# EAGLE design ESP32 (EAGLE 9.6.2)
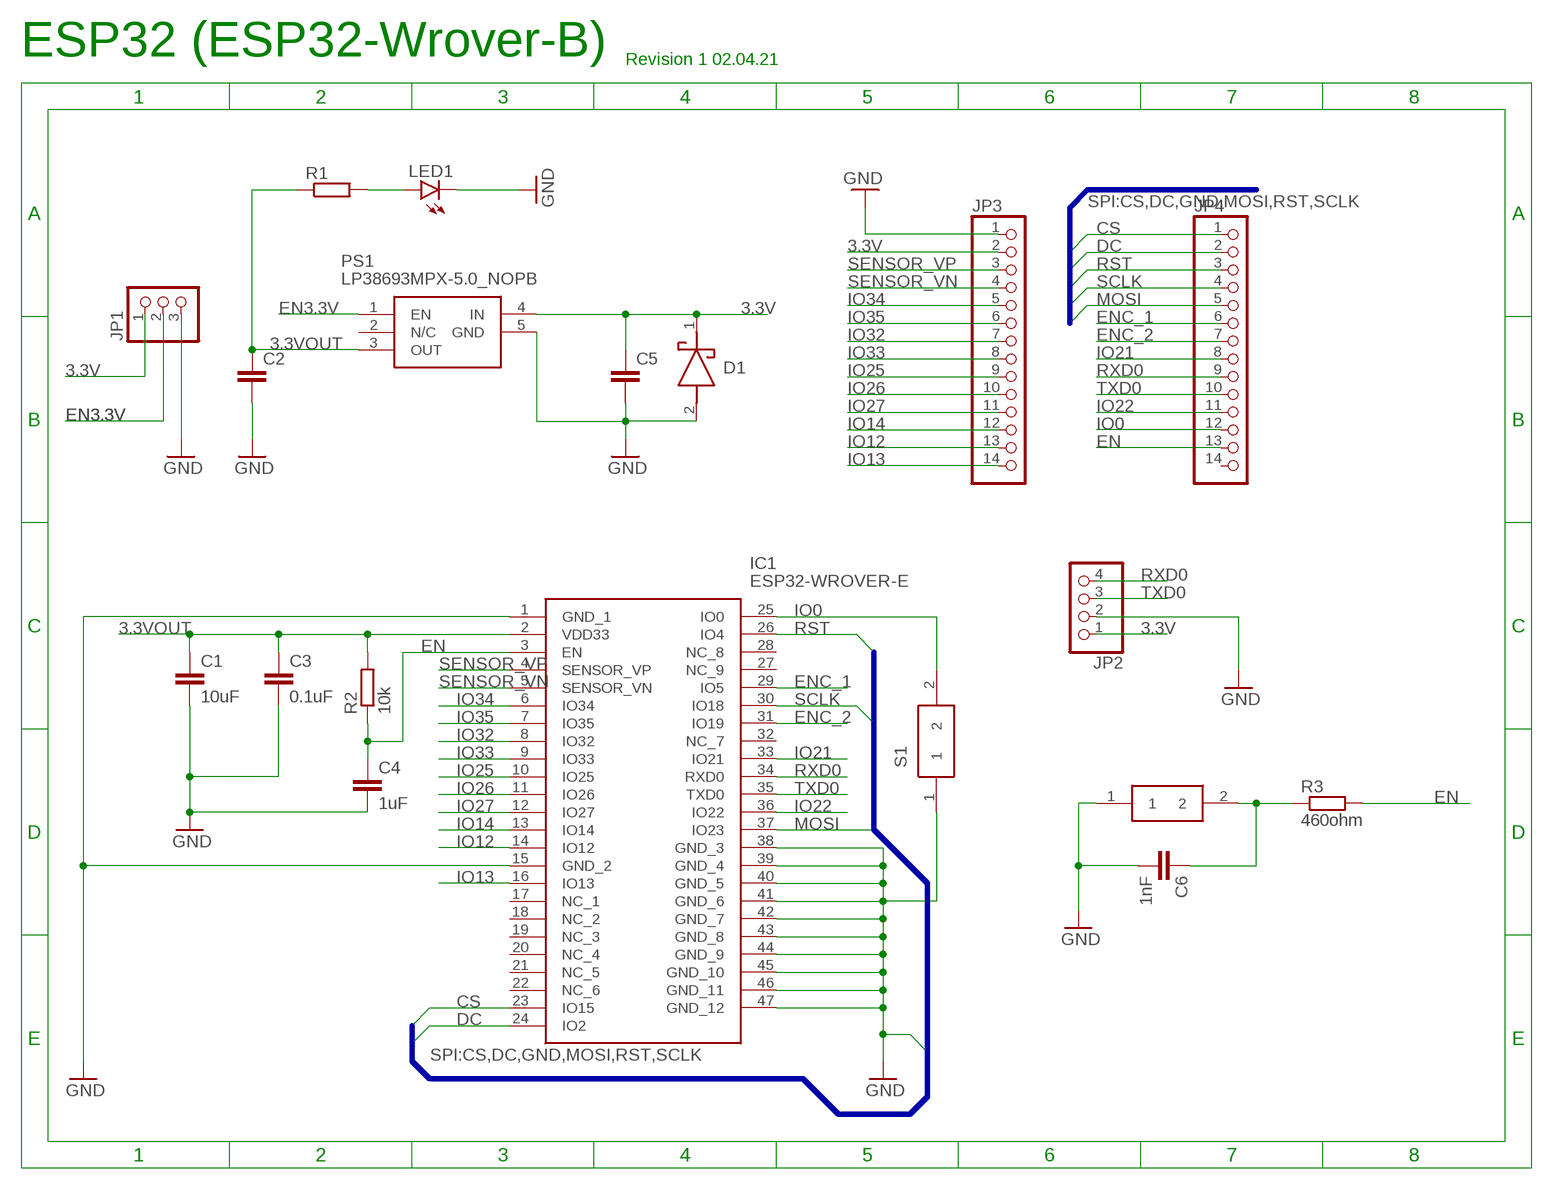
[diagram p0: schematic, sheet 1]

## Parts
C1  10uF  C-EU_1206C1206  [C1206]
C2  C-EUC0805  [C0805]
C3  0.1uF  C-EU_805C0805  [C0805]
C4  1uF  C-EU_805C0805  [C0805]
C5  C-EUC0805  [C0805]
C6  1nF  C-EU_805C0805  [C0805]
D1  LSM115JE3_TR13  [DIOM5436X330N]
IC1  ESP32-WROVER-E  [ESP32WROVERBM213DH6464PC3Q0]
JP1  PINHD-1X3  [1X03]
JP2  PINHD-1X4  [1X04]
JP3  PINHD-1X14  [1X14]
JP4  PINHD-1X14  [1X14]
LED1  LED_1206SMT1206  [1206]
PS1  LP38693MPX-5.0_NOPB  [SOT150P700X160-5N]
R1  R-EU_R0805  [R0805]
R2  10k  R-EU_805R0805  [R0805]
R3  460ohm  R-EU_805R0805  [R0805]
S1  FSMSMTR  [FSMSM]
S2  FSMSMTR  [FSMSM]

## Nets
3.3V: C5.1 D1.1(K) JP1.1 JP2.1 JP3.2 PS1.4(IN)
3.3VOUT: C1.1 C2.1 C3.1 IC1.2(VDD33) PS1.3(OUT) R1.1 R2.2
CS: IC1.23(IO15) JP4.1
DC: IC1.24(IO2) JP4.2
EN [other]: C4.1 IC1.3(EN) JP4.13 R2.1 R3.2
EN3.3V [other]: JP1.2 PS1.1(EN)
EN_1 [other]: C6.1 R3.1 S2.2
ENC_1: IC1.29(IO5) JP4.6
ENC_2: IC1.31(IO19) JP4.7
GND: C1.2 C2.2 C3.2 C4.2 C5.2 C6.2 D1.2(A) IC1.1(GND_1) IC1.15(GND_2) IC1.38(GND_3) IC1.39(GND_4) IC1.40(GND_5) IC1.41(GND_6) IC1.42(GND_7) IC1.43(GND_8) IC1.44(GND_9) IC1.45(GND_10) IC1.46(GND_11) IC1.47(GND_12) JP1.3 JP2.2 JP3.1 LED1.C PS1.5(GND) S1.1 S2.1
IO0 [other]: IC1.25(IO0) JP4.12 S1.2
IO12: IC1.14(IO12) JP3.13
IO13: IC1.16(IO13) JP3.14
IO14: IC1.13(IO14) JP3.12
IO21: IC1.33(IO21) JP4.8
IO22: IC1.36(IO22) JP4.11
IO25: IC1.10(IO25) JP3.9
IO26: IC1.11(IO26) JP3.10
IO27: IC1.12(IO27) JP3.11
IO32: IC1.8(IO32) JP3.7
IO33: IC1.9(IO33) JP3.8
IO34: IC1.6(IO34) JP3.5
IO35: IC1.7(IO35) JP3.6
MOSI: IC1.37(IO23) JP4.5
N$1: LED1.A R1.2
RST: IC1.26(IO4) JP4.3
RXD0 [other]: IC1.34(RXD0) JP2.4 JP4.9
SCLK: IC1.30(IO18) JP4.4
SENSOR_VN: IC1.5(SENSOR_VN) JP3.4
SENSOR_VP: IC1.4(SENSOR_VP) JP3.3
TXD0 [other]: IC1.35(TXD0) JP2.3 JP4.10
Unconnected: IC1.17(NC_1) IC1.18(NC_2) IC1.19(NC_3) IC1.20(NC_4) IC1.21(NC_5) IC1.22(NC_6) IC1.27(NC_9) IC1.28(NC_8) IC1.32(NC_7) JP4.14 PS1.2(N/C)

## Buses
SPI:CS,DC,GND,MOSI,RST,SCLK

## Notes on the sheet
- ESP32 (ESP32-Wrover-B)
- Revision 1 02.04.21

## Library data of the parts
C1 = CommonParts:C-EU_1206: CAPACITOR, European symbol; SPICEPREFIX: C
C2 C5 = rcl:C-EU: CAPACITOR, European symbol; SPICEPREFIX: C
C3 C4 C6 = CommonParts:C-EU_805: CAPACITOR, European symbol; SPICEPREFIX: C
D1 = CommonParts:LSM115JE3_TR13: Schottky Diodes & Rectifiers Schottky Source: Datasheet <https://componentsearchengine.com/Datasheets/1/LSM115JE3_TR13.pdf>; DESCRIPTION: Schottky Diodes & Rectifiers Schottky; HEIGHT: 3.3mm; MANUFACTURER_NAME: Microsemi Corporation; MANUFACTURER_PART_NUMBER: LSM115JE3/TR13; MOUSER_PART_NUMBER: 494-LSM115JE3/TR13; MOUSER_PRICE-STOCK: https://www.mouser.com/Search/Refine.aspx?Keyword=494-LSM115JE3%2FTR13
IC1 = MouserUseful:ESP32-WROVER-E: RX TXRX MOD WIFI PCB TRACE SMD Source: Datasheet <https://www.mouser.de/datasheet/2/891/esp32-wrover-e_esp32-wrover-ie_datasheet_en-1855913.pdf>; DESCRIPTION: RX TXRX MOD WIFI PCB TRACE SMD; HEIGHT: 3.4mm; MANUFACTURER_NAME: Espressif Systems; MANUFACTURER_PART_NUMBER: ESP32-WROVER-E(M213EH3264PH3Q0)
JP1 = pinhead:PINHD-1X3: PIN HEADER
JP2 = pinhead:PINHD-1X4: PIN HEADER
JP3 JP4 = pinhead:PINHD-1X14: PIN HEADER
LED1 = CommonParts:LED_1206: LED OSRAM: - CHIPLED LG R971, LG N971, LY N971, LG Q971, LY Q971, LO R971, LY R971 LH N974, LH R974 LS Q976, LO Q976, LY Q976 LO Q996 - Hyper CHIPLED LW Q18S LB Q993, LB Q99A, LB R99A - SideLED LS A670, LO A670, LY A670, LG A670, LP A670 LB A673, LV A673, LT A673, LW A673 LH A674 LY A675 LS A676, LA A676, LO A676, LY A676, LW A676 LS A679, LY A679, LG A679 - Hyper Micro SIDELED® LS Y876, LA Y876, LO Y876, LY Y876 LT Y87S - SmartLED LW L88C, LW L88S LB L89C, LB L89S, LG L890 LS L89K, LO L89K, LY L89K LS L896, LA L896, LO L896, LY L896 - TOPLED LS T670, LO T670, LY T670, LG T670, LP T670 LSG T670, LSP T670, LSY T670, LOP T670, LYG T670 LG T671, LOG T671, LSG T671 LB T673, LV T673, LT T673, LW T673 LH T674 LS T676, LA T676, LO T676, LY T676, LB T676, LH T676, LSB T676, LW T676 LB T67C, LV T67C, LT T67C, LS T67K, LO T67K, LY T67K, LW E67C LS E67B, LA E67B, LO E67B, LY E67B, LB E67C, LV E67C, LT E67C LW T67C LS T679, LY T679, LG T679 LS T770, LO T770, LY T770, LG T770, LP T770 LB T773, LV T773, LT T773, LW T773 LH T774 LS E675, LA E675, LY E675, LS T675 LS T776, LA T776, LO T776, LY T776, LB T776 LHGB T686 LT T68C, LB T68C - Hyper Mini TOPLED® LB M676 - Mini TOPLED Santana® LG M470 LS M47K, LO M47K, LY M47K Source: http://www.osram.convergy.de LUXEON: - LUMILED® LXK2-PW12-R00, LXK2-PW12-S00, LXK2-PW14-U00, LXK2-PW14-V00 LXK2-PM12-R00, LXK2-PM12-S00, LXK2-PM14-U00 LXK2-PE12-Q00, LXK2-PE12-R00, LXK2-PE12-S00, LXK2-PE14-T00, LXK2-PE14-U00 LXK2-PB12-K00, LXK2-PB12-L00, LXK2-PB12-M00, LXK2-PB14-N00, LXK2-PB14-P00, LXK2-PB14-Q00 LXK2-PR12-L00, LXK2-PR12-M00, LXK2-PR14-Q00, LXK2-PR14-R00 LXK2-PD12-Q00, LXK2-PD12-R00, LXK2-PD12-S00 LXK2-PH12-R00, LXK2-PH12-S00 LXK2-PL12-P00, LXK2-PL12-Q00, LXK2-PL12-R00 Source: www.luxeon.com KINGBRIGHT: KA-3528ASYC Source: www.kingbright.com
PS1 = MouserUseful:LP38693MPX-5.0_NOPB: LDO Voltage Regulators 500mA Low Dropout CMOS Linear Regulators Stable with Ceramic Output Capacitors 5-SOT-223 -40 to 125 Source: Datasheet <http://www.ti.com/lit/ds/snvs321o/snvs321o.pdf>
R1 = rcl:R-EU_: RESISTOR, European symbol; SPICEPREFIX: R
R2 R3 = CommonParts:R-EU_805: RESISTOR, European symbol
S1 S2 = FSMSMTR:FSMSMTR: Black Button Tact Switch, SPST 50 mA @ 24 V dc 1.07mm Source: Datasheet <http://www.te.com/commerce/DocumentDelivery/DDEController?Action=showdoc&DocId=Customer Drawing1437566-3C2pdfEnglishENG_CD_1437566-3_C2_1437566_3_1_c.dwg.pdf1437566-4>; ALLIED_NUMBER: 70286948; ALLIED_PRICE-STOCK: https://www.alliedelec.com/te-connectivity-fsmsmtr/70286948/; DESCRIPTION: Black Button Tact Switch, SPST 50 mA @ 24 V dc 1.07mm; HEIGHT: mm; MANUFACTURER_NAME: TE Connectivity; MANUFACTURER_PART_NUMBER: FSMSMTR; MOUSER_PART_NUMBER: 506-FSMSMTR; MOUSER_PRICE-STOCK: https://www.mouser.com/Search/Refine.aspx?Keyword=506-FSMSMTR; RS_PART_NUMBER: 1680547; RS_PRICE-STOCK: http://uk.rs-online.com/web/p/products/1680547

## Net classes
0 default: width 0.152 mm, drill 0.1 mm
1 other: width 0.152 mm, drill 0.1 mm, clearance 0.205 mm to class 0, clearance 0.205 mm

## Board
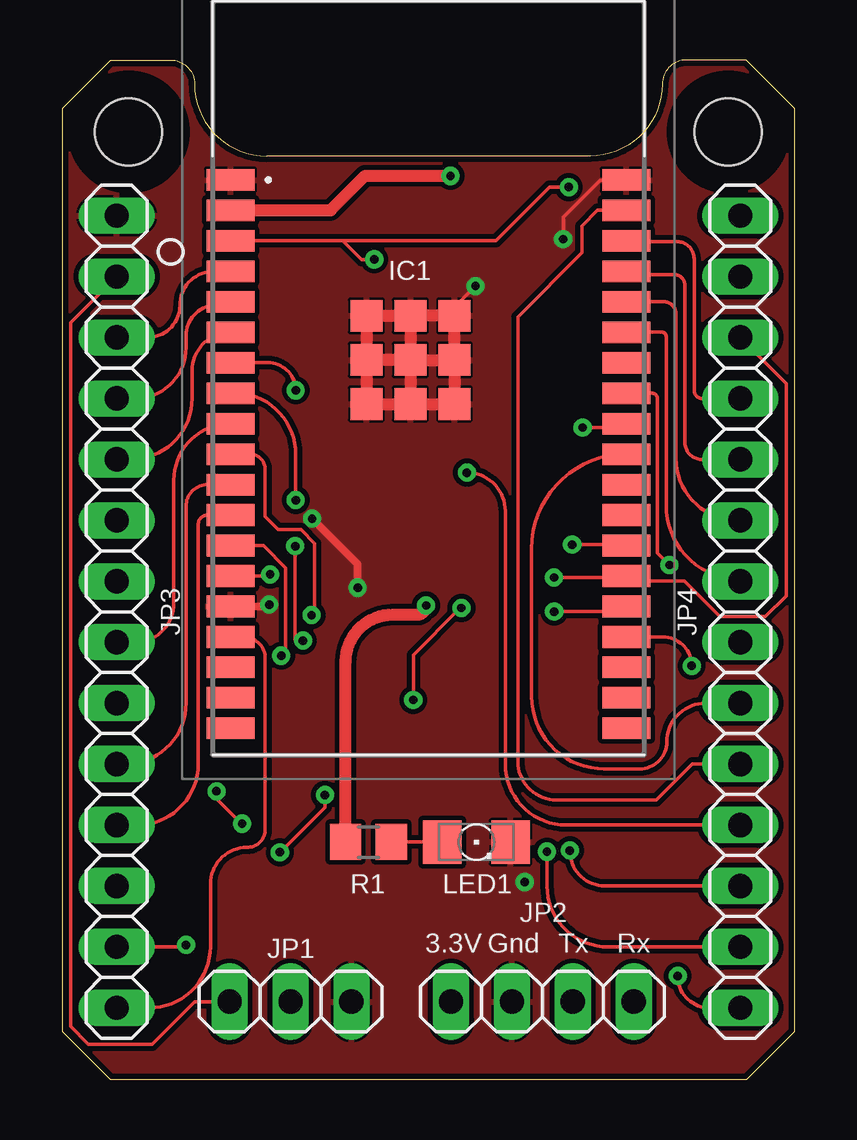
[diagram p1: board, top side]
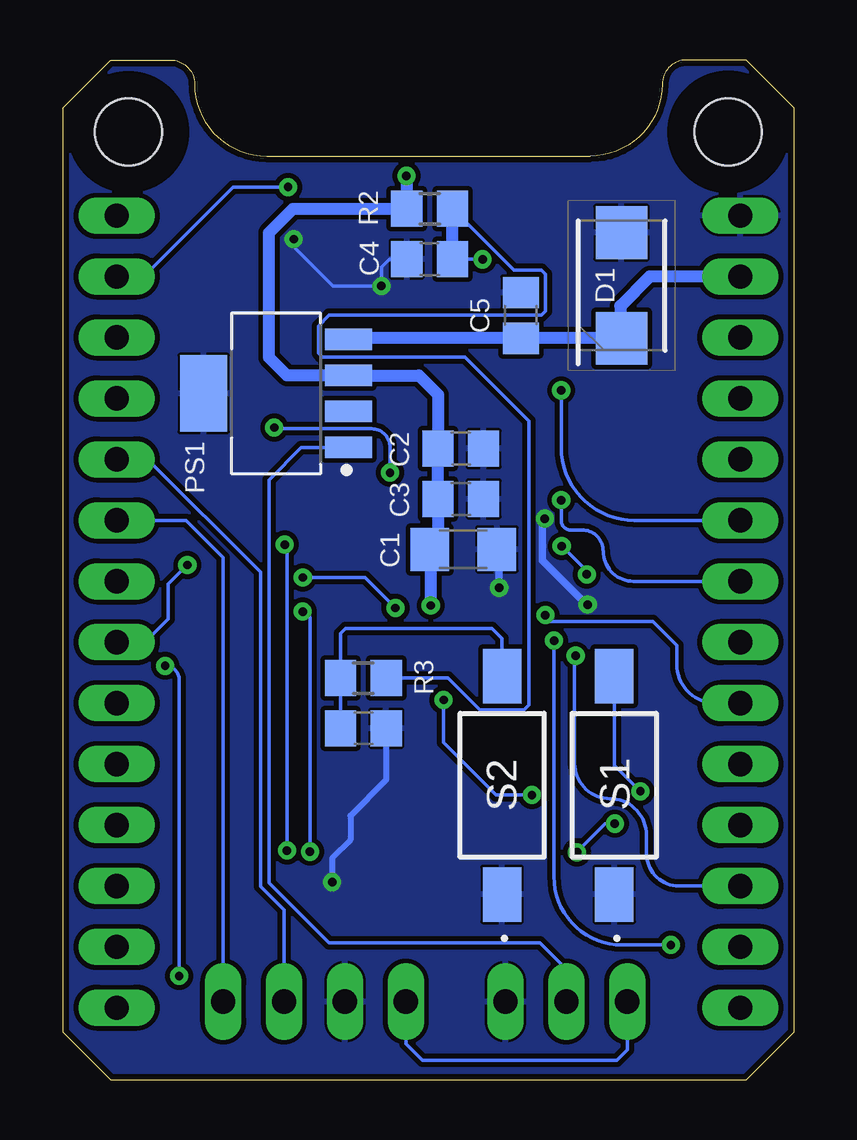
[diagram p2: board, bottom side, seen from below]

Size 30.5 x 42.5 mm. Coordinates in mm from the lower left corner, seen from the top.
Outline: 30.5,40.5 30.5,2 28.5,0 2,0 0,2 0,40.5 2,42.5 4.5,42.5 arc-90 5.5,41.5 arc90 8.5,38.5 22,38.5 arc90 25,41.5 arc-90 26,42.5 28.5,42.5 30.5,40.5
Copper layers (1*16): Top 0.035mm / dielectric 1.5mm / Bottom 0.035mm
Design rules "CNC *": minimum track width 6mil, minimum drill 0.35mm, track to track 0.2mm, track to pad 0.2mm, pad to pad 0.2mm, via to via 0.2mm, smd to smd 0.2mm, copper to edge 10mil, drill to drill 6mil, minimum pad ring 10mil, minimum via ring 8mil, stop-mask expansion 0.1mm, vias tented up to drill 0.1mm, thermal gap 0.1mm
Holes 2.8 mm at 27.75,39.5 2.75,39.5
tRestrict: area 1.5,38.2 to 4,40.8; area 26.5,38.2 to 29,40.8
bRestrict: area 1.5,38.2 to 4,40.8; area 26.5,38.2 to 29,40.8

### Footprints (pad centres in the part's own frame; a part is rotated, then mirrored left to right if it is on the bottom)
C1206 = smd 1.6 x 1.8: 1 -1.4,0; 2 1.4,0
C0805 = smd 1.3 x 1.5: 1 -0.95,0; 2 0.95,0
DIOM5436X330N = smd 2.2 x 2.15: 1 -2.2,0; 2 2.2,0
ESP32WROVERBM213DH6464PC3Q0 = smd 2 x 0.9: 1 -7.5,7.5; 2 -7.5,6.23; 3 -7.5,4.96; 4 -7.5,3.69; 5 -7.5,2.42; 6 -7.5,1.15; 7 -7.5,-0.12; 8 -7.5,-1.39; 9 -7.5,-2.66; 10 -7.5,-3.93; 11 -7.5,-5.2; 12 -7.5,-6.47; 13 -7.5,-7.74; 14 -7.5,-9.01; 15 -7.5,-10.28; 16 -7.5,-11.55; 17 -7.5,-12.82; 18 -7.5,-14.09; 19 -7.5,-15.36; 20 9,-15.36; 21 9,-14.09; 22 9,-12.82; 23 9,-11.55; 24 9,-10.28; 25 9,-9.01; 26 9,-7.74; 27 9,-6.47; 28 9,-5.2; 29 9,-3.93; 30 9,-2.66; 31 9,-1.39; 32 9,-0.12; 33 9,1.15; 34 9,2.42; 35 9,3.69; 36 9,4.96; 37 9,6.23; 38 9,7.5 | smd 1.33 x 1.33: 39 -1.835,1.835; 40 0,1.835; 41 1.835,1.835; 42 -1.835,0; 43 0,0; 44 1.835,0; 45 -1.835,-1.835; 46 0,-1.835; 47 1.835,-1.835
1X03 = drill 1.016 long: 1 -2.54,0; 2 0,0; 3 2.54,0
1X04 = drill 1.016 long: 1 -3.81,0; 2 -1.27,0; 3 1.27,0; 4 3.81,0
1X14 = drill 1.016 long: 1 -16.51,0; 2 -13.97,0; 3 -11.43,0; 4 -8.89,0; 5 -6.35,0; 6 -3.81,0; 7 -1.27,0; 8 1.27,0; 9 3.81,0; 10 6.35,0; 11 8.89,0; 12 11.43,0; 13 13.97,0; 14 16.51,0
1206 = smd 1.6 x 1.803: A -1.422,0; C 1.422,0
SOT150P700X160-5N = smd 1.965 x 0.889: 1 -3.023,2.25; 2 -3.023,0.75; 3 -3.023,-0.75; 4 -3.023,-2.25 | smd 1.965 x 3.189: 5 3.023,0
R0805 = smd 1.3 x 1.5: 1 -0.95,0; 2 0.95,0
FSMSM = smd 2.27 x 1.6: 1 -4.55,0; 2 4.55,0

### Placement (x,y rotation side)
C1  13.8,22.1 0 bottom
C2  13.9,26.3 0 bottom
C3  13.9,24.2 0 bottom
C4  15.2,34.2 180 bottom
C5  11.4,31.85 90 bottom
C6  17.96,14.64 0 bottom
D1  7.2,33.1 90 bottom
IC1  14.5,30 0 top
JP1  9.5,3.25 0 top
JP2  20,3.25 0 top
JP3  2.25,19.5 270 top
JP4  28.25,19.5 90 top
LED1  17.25,9.9 0 top
PS1  21.6,28.6 180 bottom
R1  12.75,9.9 0 top
R2  15.2,36.3 180 bottom
R3  17.96,16.73 0 bottom
S1  7.5,12.26 90 bottom
S2  12.18,12.26 90 bottom

### Tracks (layer width: path | path; a pad name or v marks a point on that pad's centre or on a via)
3.3V
  Top 0.152: JP1.1 5.5,3.25 3.72,1.47 1.07,1.47 0.33,2.21 0.33,31.55 JP3.2
  Bottom 0.152: JP1.1 6.96,1.24 7.4,0.8 15.5,0.8 16.19,1.49 JP2.1
  Bottom 0.5: JP3.2 6.03,33.47 7.25,32.25 7.25,30.95 D1.1 | C5.1 18.53,30.9 PS1.4
  Bottom 0.508: D1.1 C5.1
3.3VOUT  (via drill 0.35)
  Top 0.5: R1.1 11.8,17.42 arc-90 13.76,19.38 14.77,19.38 arc90 v15.15,19.76 | IC1.2 11.18,36.23 12.61,37.67 v16.17,37.67
  Bottom 0.5: v15.15,19.76 15.15,22.05 arc-90 C1.1 14.85,22.45 C3.1 C2.1 14.85,28.55 15.65,29.35 PS1.3 21.15,29.35 21.9,30.1 21.9,35.3 20.9,36.3 R2.2 16.17,36.32 v16.17,37.67
CS  (via drill 0.35)
  Top 0.152: JP4.1 26.97,2.99 arc-90 v25.64,4.32 | v26.23,17.25 arc90 25.02,18.45 IC1.23
  Bottom 0.152: v25.64,4.32 25.64,16.66 arc-90 v26.23,17.25
DC  (via drill 0.35)
  Top 0.152: JP4.2 22.73,5.53 arc-90 20.19,8.07 v20.19,9.5 | v20.49,19.51 23.29,19.51 arc90 IC1.24
  Bottom 0.152: v20.19,9.5 20.19,19.2 arc-90 v20.49,19.51
EN  (via drill 0.35)
  Top 0.152: v12.99,34.19 12.46,34.19 11.67,34.97 | 11.67,34.97 7.01,34.97 IC1.3 | 11.67,34.97 18.07,34.97 20.3,37.2 v21.1,37.2
  Bottom 0.152: R3.2 14.43,16.73 13.1,15.4 11.26,15.4 11.06,15.61 11.06,27.46 13.72,30.12 19.68,30.12 19.84,30.29 19.84,31.41 19.38,31.87 10.53,31.87 10.37,32.03 10.37,33.57 10.53,33.73 11.68,33.73 R2.1 | C4.1 13.01,34.2 v12.99,34.19 | v21.1,37.2 23.4,37.2 27.13,33.47 JP4.13
  Bottom 0.5: C4.1 R2.1
EN3.3V
  Bottom 0.152: JP1.2 9.5,4.6 10.6,5.7 19.4,5.7 21.9,8.2 21.9,25 20.55,26.35 PS1.1
EN_1
  Bottom 0.152: S2.2 12.18,18.38 12.6,18.8 18.7,18.8 18.91,18.59 R3.1 C6.1
ENC_1
  Top 0.152: JP4.6 26.8,15.69 arc90 25.18,14.07 arc-90 24.07,12.95 22.57,12.95 arc-90 19.55,15.97 19.55,22.12 arc-90 IC1.29
ENC_2  (via drill 0.35)
  Top 0.152: IC1.31 24.56,28.61 arc-90 24.8,28.37 24.8,21.95 v25.3,21.45
  Bottom 0.152: v25.3,21.45 26.1,20.65 26.1,19.2 27.07,18.23 JP4.7
GND  (via drill 0.35)
  Top 0.152: IC1.41 16.34,32.2 v17.21,33.08 | v20.87,35.03 20.87,35.95 22.42,37.5 IC1.38
  Top 0.305: IC1.15 8.53,19.72 v8.61,19.8 | v10.4,23.38 12.3,21.48 v12.3,20.5
  Top 0.5: IC1.40 IC1.39 IC1.42 | IC1.40 IC1.41 IC1.44 | IC1.40 IC1.43 | IC1.43 IC1.44 | IC1.44 IC1.47 IC1.46 | IC1.42 IC1.45 IC1.46 | IC1.43 IC1.46 | IC1.43 IC1.42
  Bottom 0.152: C4.2 16.88,34.2 17.21,33.87 v17.21,33.08 19.23,33.08 20.87,34.72 v20.87,35.03
  Bottom 0.254: C6.2 17.01,12.49 18.5,11 18.5,10 19.26,9.24 v19.26,8.23
  Bottom 0.305: v8.61,19.8 8.66,19.8 10.5,21.64 10.5,23.28 v10.4,23.38 | v12.3,20.5 12.3,22 C1.2
  pour Top: 0,0 30.51,0 30.51,42.5 0,42.5
  pour Bottom: 0,0 30.54,0 30.54,42.5 0,42.5
IO0  (via drill 0.35)
  Top 0.152: v6.41,12.01 6.41,11.71 7.46,10.67 v7.48,10.67 | v9.06,9.47 10.94,11.35 v10.94,11.86 | v14.62,15.82 14.62,17.7 16.52,19.61 16.57,19.61 v16.62,19.66 | v20.49,20.93 23.44,20.93 IC1.25 23.7,20.79 25.91,20.79 27.4,19.3 29.3,19.3 30.16,20.16 30.16,29.02 JP4.12
  Bottom 0.152: S1.2 7.5,13.1 v6.41,12.01 | v7.48,10.67 7.89,10.67 9.08,9.47 v9.06,9.47 | v10.94,11.86 12.43,11.86 14.62,14.04 v14.62,15.82 | v20.49,20.93 17.89,20.93 v16.62,19.66
IO12  (via drill 0.35)
  Top 0.152: JP3.13 5.06,5.53 arc90 v5.14,5.61 | v8.65,21.05 arc90 8.58,20.99 IC1.14 | v10.02,18.3 9.72,18.3 9.69,18.32 v9.69,22.23
  Bottom 0.152: v5.14,5.61 7.18,5.61 arc90 10.02,8.45 v10.02,18.3 | v9.69,22.23 8.65,21.19 v8.65,21.05
IO13
  Top 0.152: JP3.14 3.62,2.99 arc90 6.16,5.53 6.16,8.15 arc-90 7.68,9.68 arc90 8.45,10.44 8.45,17.55 arc90 7.55,18.45 IC1.16
IO14  (via drill 0.35)
  Top 0.152: v9.11,17.67 9.3,17.86 9.3,21.33 8.37,22.26 IC1.13
  Bottom 0.152: JP3.12 4.81,8.07 arc90 6.16,9.42 6.16,10.18 arc-90 7.68,11.71 arc90 9.16,13.18 9.16,17.62 v9.11,17.67
IO21
  Top 0.152: JP4.8 28.25,20.85 arc-90 25.16,23.94 25.16,30.99 arc90 25,31.15 IC1.33
IO22
  Top 0.152: IC1.36 arc90 23.54,34.92 25.62,34.92 arc-90 26.33,34.21 26.33,28.73 arc90 26.66,28.39 JP4.11
IO25  (via drill 0.35)
  Top 0.152: v10.38,19.36 10.5,19.36 10.5,22.35 9.93,22.92 8.99,22.92 8.45,23.46 8.45,25.42 arc90 7.8,26.07 IC1.10
  Bottom 0.152: JP3.9 3.28,15.69 arc90 4.89,17.3 4.89,18.09 5.9,19.1 10.38,19.1 v10.38,19.36
IO26
  Top 0.152: JP3.10 2.6,13.15 arc90 5.14,15.69 5.14,23.9 arc-90 6.04,24.8 IC1.11
IO27
  Top 0.152: JP3.11 3.11,10.61 arc90 5.65,13.15 5.65,23.14 arc-90 6.04,23.53 IC1.12
IO32  (via drill 0.35)
  Top 0.152: v9.72,24.15 9.72,26.07 arc90 7.18,28.61 IC1.8
  Bottom 0.152: v9.72,24.15 9.72,23.31 arc-90 9.31,22.91 8.85,22.91 arc90 7.96,22.02 arc-90 6.71,20.77 JP3.7
IO33
  Top 0.152: JP3.8 3.03,18.23 arc90 4.64,19.84 4.64,24.98 arc-90 IC1.9
IO34
  Top 0.152: JP3.5 2.86,25.85 arc90 5.4,28.39 5.4,29.55 arc-90 IC1.6
IO35  (via drill 0.35)
  Top 0.152: v9.72,28.73 arc90 8.56,29.88 IC1.7
  Bottom 0.152: JP3.6 6.67,23.31 arc90 9.72,26.36 v9.72,28.73
MOSI
  Top 0.152: JP4.5 26.25,13.15 24.75,11.66 20.59,11.66 arc-90 18.97,13.27 18.97,31.79 21.64,34.46 21.64,35.58 22.3,36.24 IC1.37
N$1
  Top 0.152: LED1.A R1.2
RST  (via drill 0.35)
  Top 0.152: JP4.3 22.6,8.07 arc-90 21.15,9.52 v21.15,9.55 | v21.24,22.3 23.46,22.3 arc-90 IC1.26
  Bottom 0.152: v21.15,9.55 21.15,22.2 arc-90 v21.24,22.3
RXD0
  Top 0.152: JP4.9 28.16,23.31 arc-90 25.57,25.9 25.57,31.93 arc90 25.07,32.42 IC1.34
  Bottom 0.152: JP2.4 23.81,21.77 25.35,23.31 JP4.9
SCLK  (via drill 0.35)
  Top 0.152: JP4.4 20.99,10.61 arc-90 18.45,13.15 18.45,23.7 arc90 v16.85,25.3 | v21.68,27.18 23.34,27.18 arc90 IC1.30
  Bottom 0.152: v16.85,25.3 16.85,26.36 arc-90 17.61,27.13 21.63,27.13 arc90 v21.68,27.18
SENSOR_VN
  Top 0.152: JP3.4 3.03,28.39 arc90 5.14,30.5 5.14,31.01 arc-90 6.41,32.28 6.86,32.28 arc90 IC1.5
SENSOR_VP
  Top 0.152: JP3.3 3.54,30.93 arc90 4.89,32.28 arc-90 6.3,33.69 IC1.4
TXD0
  Top 0.152: IC1.35 arc90 23.64,33.55 25.49,33.55 arc-90 25.95,33.1 25.95,26.54 arc90 26.64,25.85 JP4.10
  Bottom 0.152: JP2.3 21.27,7.07 22.26,8.05 22.26,21.16 26.95,25.85 JP4.10

### Text on the board
tNames: 3.3V | Gnd | Tx | Rx